# Altium schematic sheet MCU.SchDoc
size A4; DocumentNumber: 1; SheetNumber: 1; SheetTotal: 4
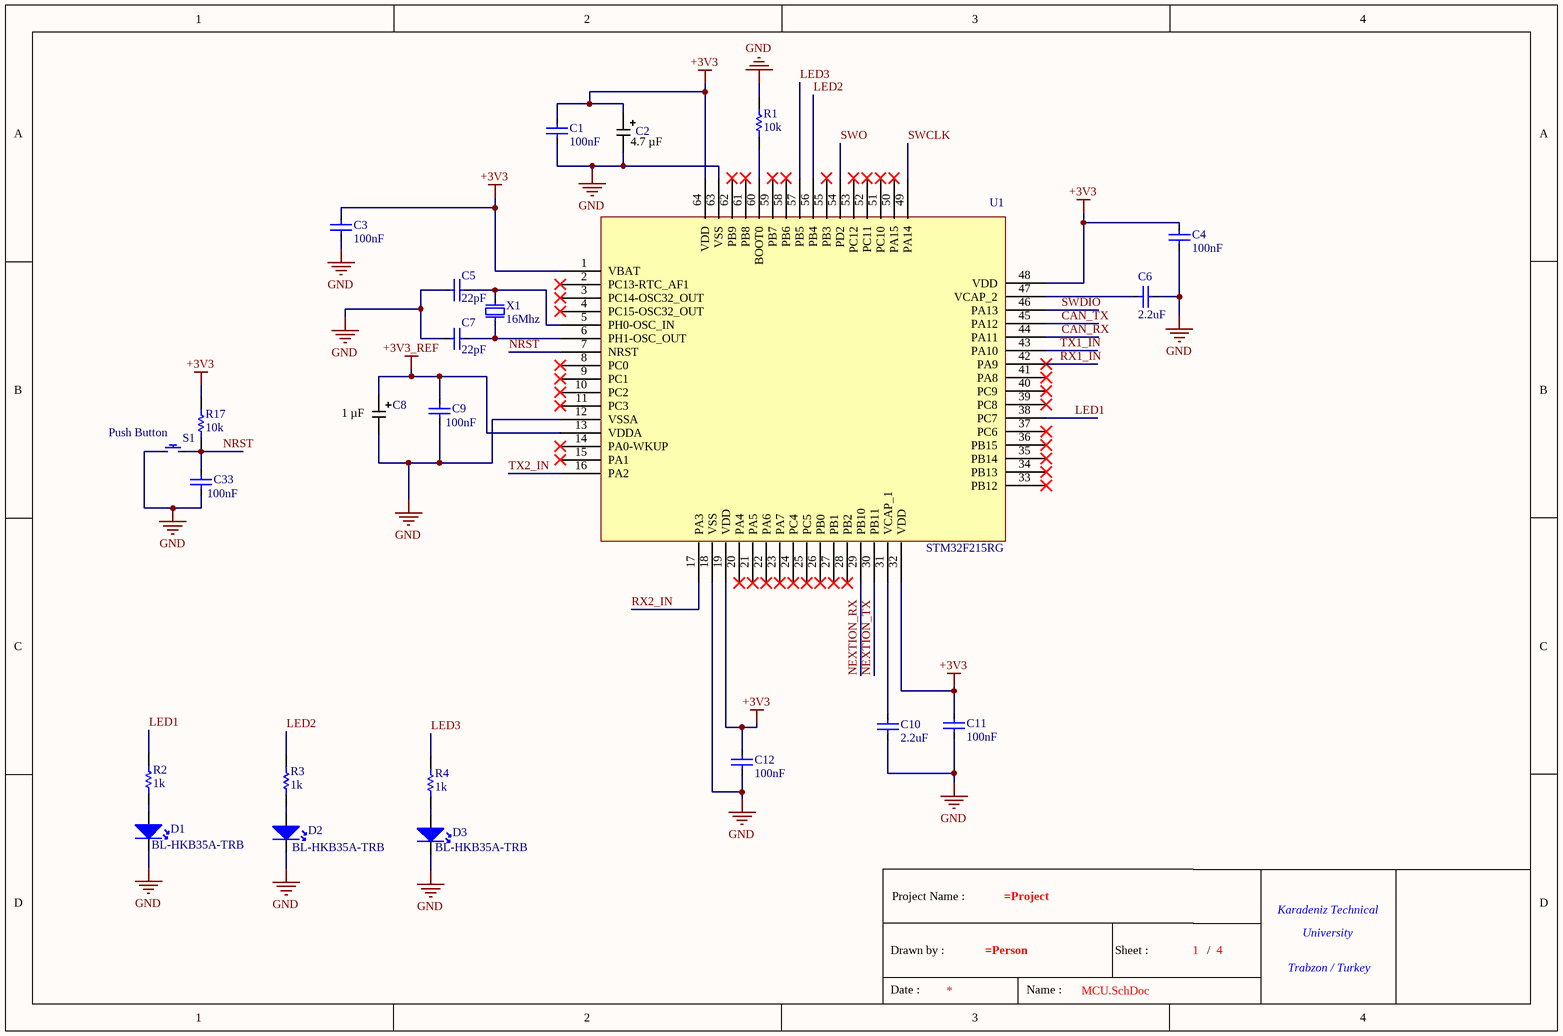
[diagram p0: MCU.SchDoc]

## Parts
*  Title Block  (value not drawn)  (graphical)
C1  100nF  [CAP-0603]
C2  Capacitance: 4.7 µF  [KEMET_CAP_TAN-B]  (hidden comment: T491B475K016AT)
C3  100nF  [CAP-0603]
C4  100nF  [CAP-0603]
C5  22pF  [CAP-0805]
C6  2.2uF  [CAP-0805]
C7  22pF  [CAP-0805]
C8  Capacitance: 1 µF  [KEMET_CAP_TAN-B]  (hidden comment: T491B105K025AT)
C9  100nF  [CAP-0603]
C10  2.2uF  [CAP-0805]
C11  100nF  [CAP-0603]
C12  100nF  [CAP-0603]
C33  100nF  [CAP-0603]
D1  BL-HKB35A-TRB  [LED-0805]
D2  BL-HKB35A-TRB  [LED-0805]
D3  BL-HKB35A-TRB  [LED-0805]
R1  10k  [RES-0603]
R2  1k  [RES-0603]
R3  1k  [RES-0603]
R4  1k  [RES-0603]
R17  10k  [RES-0603]
S1  Push Button  [2.54mm_Push Button]  (no BOM)
U1  STM32F215RG  [LQFP64]
X1  16Mhz  [OSC-THT (11.5*5.00*3.60)]

## Nets
+3V3: C1.2 C2.1 C3.2 C4.2 C11.2 C12.2 R17.1 U1.1(VBAT) U1.19(VDD) U1.32(VDD) U1.48(VDD) U1.64(VDD)
+3V3_REF: C8.1 C9.2 U1.13(VDDA)
GND: C1.1 C2.2 C3.1 C4.1 C5.2 C6.1 C7.1 C8.2 C9.1 C10.1 C11.1 C12.1 C33.1 D1.2(K) D2.2(K) D3.2(K) R1.2 S1.1 U1.12(VSSA) U1.18(VSS) U1.63(VSS)
CAN_RX: U1.44(PA11)
CAN_TX: U1.45(PA12)
LED1: R2.1 U1.38(PC7)
LED2: R3.1 U1.56(PB4)
LED3: R4.1 U1.57(PB5)
NEXTION_RX: U1.29(PB10)
NEXTION_TX: U1.30(PB11)
NRST: C33.2 R17.2 S1.2 U1.7(NRST)
RX1_IN: U1.42(PA9)
RX2_IN: U1.17(PA3)
SWCLK: U1.49(PA14)
SWDIO: U1.46(PA13)
SWO: U1.54(PD2)
TX1_IN: U1.43(PA10)
TX2_IN: U1.16(PA2)
NetC5_1: C5.1 U1.5(PH0-OSC_IN) X1.2
NetC6_2: C6.2 U1.47(VCAP_2)
NetC7_2: C7.2 U1.6(PH1-OSC_OUT) X1.1
NetC10_2: C10.2 U1.31(VCAP_1)
NetD1_1: D1.1(A) R2.2
NetD2_1: D2.1(A) R3.2
NetD3_1: D3.1(A) R4.2
NetR1_1: R1.1 U1.60(BOOT0)

Not connected (* = marked no-connect by the designer): U1 2(PC13-RTC_AF1)* 3(PC14-OSC32_OUT)* 4(PC15-OSC32_OUT)* 8(PC0)* 9(PC1)* 10(PC2)* 11(PC3)* 14(PA0-WKUP)* 15(PA1)* 20(PA4)* 21(PA5)* 22(PA6)* 23(PA7)* 24(PC4)* 25(PC5)* 26(PB0)* 27(PB1)* 28(PB2)* 33(PB12)* 34(PB13)* 35(PB14)* 36(PB15)* 37(PC6)* 39(PC8)* 40(PC9)* 41(PA8)* 50(PA15)* 51(PC10)* 52(PC11)* 53(PC12)* 55(PB3)* 58(PB6)* 59(PB7)* 61(PB8)* 62(PB9)*

## Notes on the sheet
- (in symbol Title Block) Project Name :; Karadeniz Technical; University; Drawn by :; Sheet :; /; Trabzon / Turkey; Date :; Name :

## Library data of the parts
* = Title Block: Standart Title Block
C1 C3 C4 C9 C11 C12 C33 = CGA3E2X7R1H104K080AA: Manufacturer: TDK; Temperature Coefficient: X7R; Voltage: 50V; Library Reference: Capacitor; Tolerance: %10; Man Code: CGA3E2X7R1H104K080AA; Value: 100nF; Footprint: 0603; Component Type: Ceramic Capacitor
C2 = T491B475K016AT: CAP TANT 4.7UF 10% 16V 1411; Manufacturer: KEMET; Manufacturer Size Code: B; Type: Molded; ESR (Equivalent Series Resistance): 3.5 Ohm; Lifetime @ Temp.: 2000 Hrs @ 125°C; Series: T491; Package: Tape & Reel (TR); Tolerance: ±10%; Operating Temperature: -55°C ~ 125°C; Mounting Type: Surface Mount; Package / Case: 1411 (3528 Metric); Size / Dimension: 0.138" L x 0.110" W (3.50mm x 2.80mm); Height - Seated (Max): 0.083" (2.10mm); Lead Spacing: -; Ratings: -; Features: General Purpose; Failure Rate: -; Voltage - Rated: 16 V; Ozdisan Link: https://ozdisan.com/pasif-komponentler/kondansatorler/tantal-kondansatorler/T491B475K016AT; Digikey Link: https://www.digikey.com/en/products/detail/kemet/T491B475K016AT/818582; Farnell TR Link: https://tr.farnell.com/kemet/t491b475k016at/cap-4-7-f-16v-10-smd/dp/1457453?st=t491b475k016at; Mouser Link: https://www.mouser.com.tr/ProductDetail/KEMET/T491B475K016AT?qs=pWsseJt92L15yATvg%252BRzxw%3D%3D
C5 C7 = CL21C220JBANNNC: Manufacturer: Samsung Electro-Mechanics; Temperature Coefficient: C0G; Voltage: 50V; Library Reference: Capacitor; Tolerance: %5; Man Code: CL21C220JBANNNC; Value: 22pF; Footprint: 0805; Component Type: Ceramic Capacitor
C6 C10 = CL21B225KAFVPNE_1: Manufacturer: Samsung Electro-Mechanics; Library Reference: Capacitor; Temperature Coefficient: X7R; Tolerance: %10; Voltage: 25V; Component Type: Ceramic Capacitor; Footprint: 0805; Man Code: CL21B225KAFVPNE; Value: 2.2uF
C8 = T491B105K025AT: CAP TANT 1UF 10% 25V 1411; Manufacturer: KEMET; Manufacturer Size Code: B; Type: Molded; ESR (Equivalent Series Resistance): 5 Ohm; Lifetime @ Temp.: 2000 Hrs @ 125°C; Series: T491; Package: Tape & Reel (TR); Tolerance: ±10%; Operating Temperature: -55°C ~ 125°C; Mounting Type: Surface Mount; Package / Case: 1411 (3528 Metric); Size / Dimension: 0.138" L x 0.110" W (3.50mm x 2.80mm); Height - Seated (Max): 0.083" (2.10mm); Lead Spacing: -; Ratings: -; Features: General Purpose; Failure Rate: -; Voltage - Rated: 25 V; Ozdisan Link: https://ozdisan.com/pasif-komponentler/kondansatorler/tantal-kondansatorler/T491B105K025AT; Digikey Link: https://www.digikey.com/en/products/detail/kemet/T491B105K025AT/3724810; Farnell TR Link: https://tr.farnell.com/kemet/t491b105k025at/cap-1-f-25v-10/dp/2321211?st=t491b105k025at; Mouser Link: https://www.mouser.com.tr/ProductDetail/KEMET/T491B105K025AT?qs=MSnLt6VizIVP1rbCgJ%252B8hw%3D%3D
D1-D3 = BL-HKB35A-TRB: Manufacturer: BRIGHT LED; Colour: Yellow; Vf: 2.2V; Library Reference: Miscellaneous; Luminous Intensity: 94mcd; If: 20mA; Lens Transparency: Water Clear; Man Code: BL-HKB35A-TRB; Footprint: 0805; Component Type: Led
R1 R17 = CRCW060310K0FKEA: Manufacturer: Vishay; Tolerance: %1; Power: 0.1W; Library Reference: Resistor; Man Code: CRCW060310K0FKEA; Value: 10k; Footprint: 0603; Component Type: Chip Resistor
R2-R4 = CRCW06031K00FKEAC: Manufacturer: Vishay; Library Reference: Resistor; Tolerance: %1; Power: 0.1W; Man Code: CRCW06031K00FKEAC; Footprint: 0603; Component Type: Chip Resistor; Value: 1k
S1 = Push Button: Library Reference: Other Switches; Component Type: Push Button
U1 = STM32F215RG: Manufacturer: STM; Speed: 120 mHz; Program Memory Size: 1 MB; Supply Voltage: 1.8V-3.6V; Number of Bits: 32; Number of I/O: 51; Component Type: Microcontroller; Man Code: STM32F215RG
X1 = AS49S-16M-FC160F3: Manufacturer: ANSEN; Frequency Tolerance: 20ppm; Frequency Stability: 50ppm; Library Reference: Miscellaneous; Capacitance: 16pF; ESR: 30ohm; Man Code: AS49S-16M-FC160F3; Value: 16Mhz; Component Type: Crystal Oscillator; Footprint: THT (11.5*5.00*3.60)